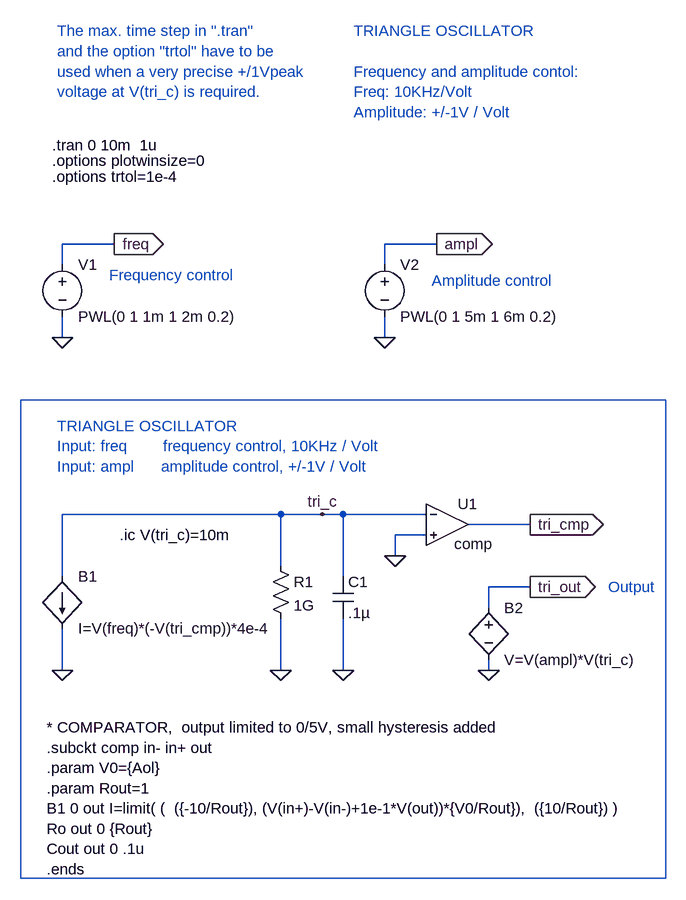
[diagram p0: schematic TriangleOsc_Fm&Am.asc]
TriangleOsc_Fm&Am.asc, the LTspice schematic file:
Version 4
SHEET 1 1272 932
WIRE -544 -208 -544 -240
WIRE -544 -96 -544 -128
WIRE -544 272 -544 176
WIRE -544 416 -544 352
WIRE -464 -240 -544 -240
WIRE -208 176 -544 176
WIRE -208 256 -208 176
WIRE -208 416 -208 336
WIRE -144 176 -208 176
WIRE -112 176 -144 176
WIRE -112 272 -112 176
WIRE -112 416 -112 336
WIRE -48 -208 -48 -240
WIRE -48 -96 -48 -128
WIRE -32 240 -32 208
WIRE 16 176 -112 176
WIRE 16 208 -32 208
WIRE 32 -240 -48 -240
WIRE 112 320 112 288
WIRE 112 416 112 400
WIRE 176 192 80 192
WIRE 176 288 112 288
FLAG -112 416 0
FLAG -32 240 0
FLAG 176 192 tri_cmp
IOPIN 176 192 Out
FLAG -544 416 0
FLAG -208 416 0
FLAG -144 176 tri_c
FLAG 176 288 tri_out
IOPIN 176 288 Out
FLAG 112 416 0
FLAG -544 -96 0
FLAG -464 -240 freq
IOPIN -464 -240 Out
FLAG -48 -96 0
FLAG 32 -240 ampl
IOPIN 32 -240 Out
SYMBOL cap -128 272 R0
SYMATTR InstName C1
SYMATTR Value .1µ
SYMBOL Opamps\\opamp 48 128 R0
WINDOW 3 11 94 Left 0
SYMATTR Value comp
SYMATTR InstName U1
SYMBOL bi -544 272 R0
SYMATTR InstName B1
SYMATTR Value I=V(freq)*(-V(tri_cmp))*4e-4
SYMBOL res -224 240 R0
SYMATTR InstName R1
SYMATTR Value 1G
SYMBOL bv 112 304 R0
SYMATTR InstName B2
SYMATTR Value V=V(ampl)*V(tri_c)
SYMATTR Value2 tripdt=0.1u
SYMBOL voltage -544 -224 R0
WINDOW 123 0 0 Left 0
WINDOW 39 0 0 Left 0
SYMATTR InstName V1
SYMATTR Value PWL(0 1 1m 1 2m 0.2)
SYMBOL voltage -48 -224 R0
WINDOW 123 0 0 Left 0
WINDOW 39 0 0 Left 0
SYMATTR InstName V2
SYMATTR Value PWL(0 1 5m 1 6m 0.2)
TEXT -568 504 Left 0 !* COMPARATOR,  output limited to 0/5V, small hysteresis added\n.subckt comp in- in+ out\n.param V0={Aol}\n.param Rout=1\nB1 0 out I=limit( (  ({-10/Rout}), (V(in+)-V(in-)+1e-1*V(out))*{V0/Rout}),  ({10/Rout}) ) \nRo out 0 {Rout}\nCout out 0 .1u\n.ends
TEXT -560 -392 Left 0 !.tran 0 10m  1u
TEXT -456 208 Left 0 !.ic V(tri_c)=10m
TEXT -560 -368 Left 0 !.options plotwinsize=0
TEXT -560 -344 Left 0 !.options trtol=1e-4
TEXT -96 -568 Left 0 ;TRIANGLE OSCILLATOR\n \nFrequency and amplitude contol:\nFreq: 10KHz/Volt\nAmplitude: +/-1V / Volt
TEXT -472 -192 Left 0 ;Frequency control
TEXT 24 -184 Left 0 ;Amplitude control
TEXT -552 40 Left 0 ;TRIANGLE OSCILLATOR \nInput: freq        frequency control, 10KHz / Volt\nInput: ampl      amplitude control, +/-1V / Volt
TEXT -552 -568 Left 0 ;The max. time step in ".tran" \nand the option "trtol" have to be\nused when a very precise +/1Vpeak \nvoltage at V(tri_c) is required.
TEXT 296 288 Left 0 ;Output
RECTANGLE Normal 384 736 -608 0

The netlist it stands for:
* TriangleOsc_Fm&Am.asc
C1 tri_c 0 .1µ
XU1 tri_c 0 tri_cmp comp Aol=100K GBW=10Meg  ; pins invin noninvin out
B1 tri_c 0 I=V(freq)*(-V(tri_cmp))*4e-4
R1 tri_c 0 1G
B2 tri_out 0 V=V(ampl)*V(tri_c) tripdt=0.1u
V1 freq 0 PWL(0 1 1m 1 2m 0.2)
V2 ampl 0 PWL(0 1 5m 1 6m 0.2)
* COMPARATOR,  output limited to 0/5V, small hysteresis added
.subckt comp in- in+ out
.param V0={Aol}
.param Rout=1
B1 0 out I=limit( (  ({-10/Rout}), (V(in+)-V(in-)+1e-1*V(out))*{V0/Rout}),  ({10/Rout}) )
Ro out 0 {Rout}
Cout out 0 .1u
.ends
.tran 0 10m  1u
.ic V(tri_c)=10m
.options plotwinsize=0
.options trtol=1e-4
* TRIANGLE OSCILLATOR
* Frequency and amplitude contol:
* Freq: 10KHz/Volt
* Amplitude: +/-1V / Volt
* Frequency control
* Amplitude control
* TRIANGLE OSCILLATOR
* Input: freq        frequency control, 10KHz / Volt
* Input: ampl      amplitude control, +/-1V / Volt
* The max. time step in ".tran"
* and the option "trtol" have to be
* used when a very precise +/1Vpeak
* voltage at V(tri_c) is required.
* Output
.backanno
.end